# Altium schematic sheet SterUni_V1.SchDoc
size A4
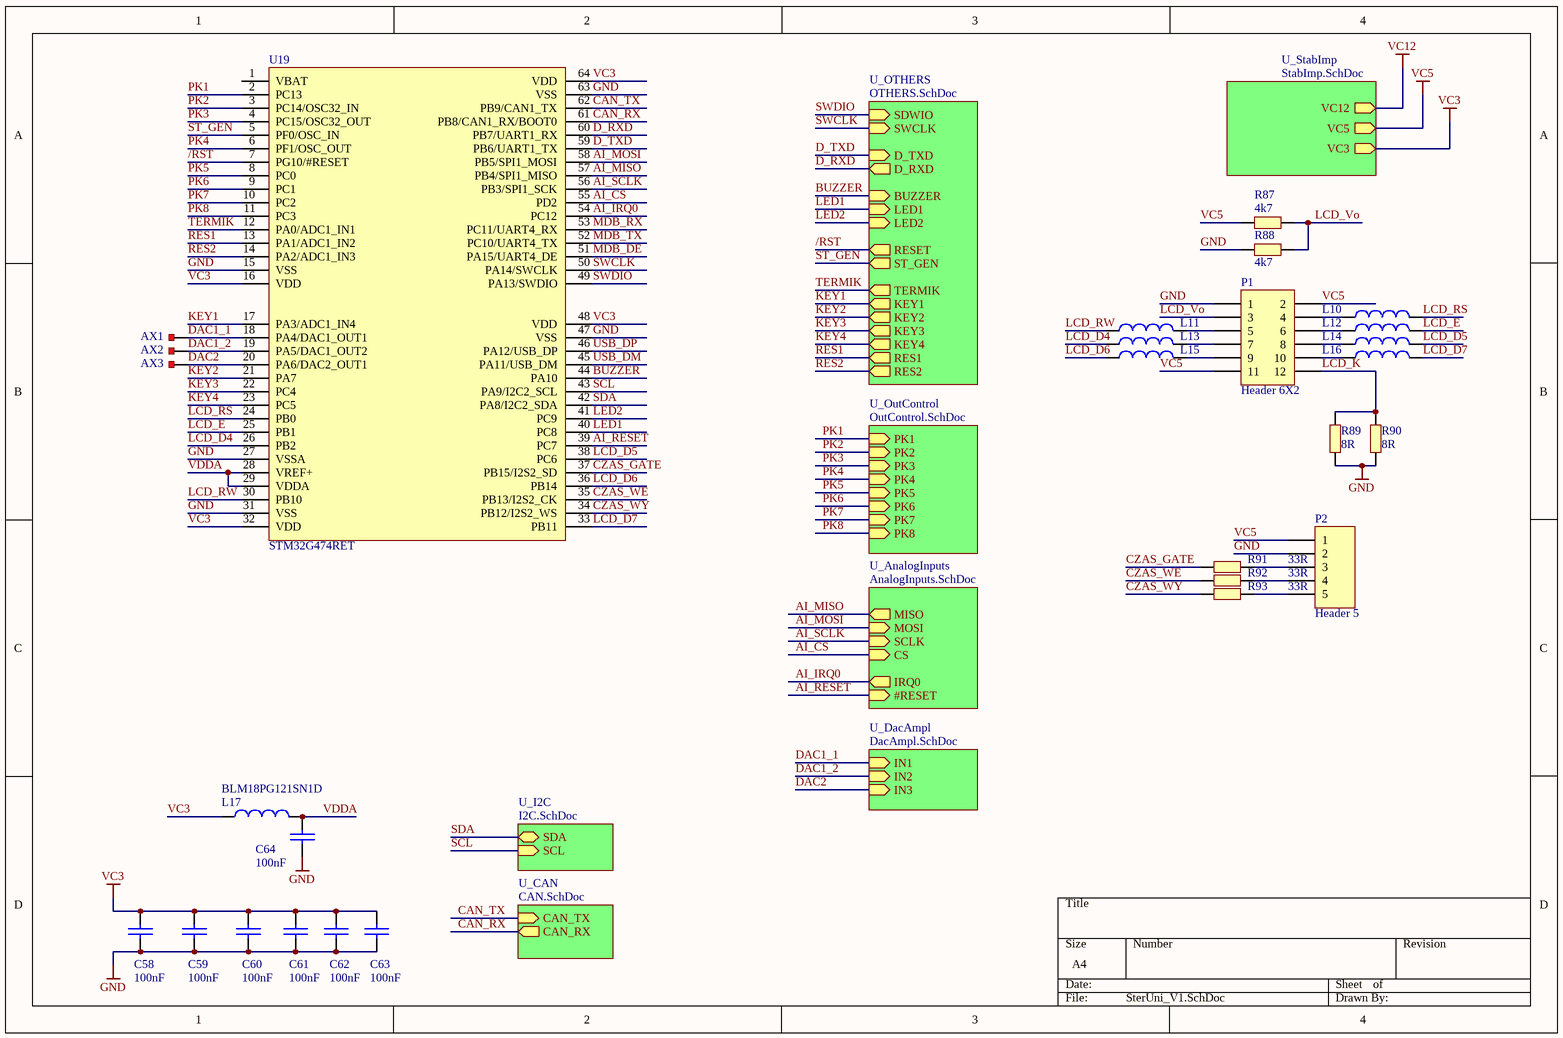
[diagram p0: SterUni_V1.SchDoc]

## Parts
AX1  (no value)  [PP_SMD4]
AX2  (no value)  [PP_SMD4]
AX3  (no value)  [PP_SMD4]
C58  100nF  [0603C]
C59  100nF  [0603C]
C60  100nF  [0603C]
C61  100nF  [0603C]
C62  100nF  [0603C]
C63  100nF  [0603C]
C64  100nF  [0603C]
L10  BLM18PG121SN1D  [0603L]  (value not drawn)
L11  BLM18PG121SN1D  [0603L]  (value not drawn)
L12  BLM18PG121SN1D  [0603L]  (value not drawn)
L13  BLM18PG121SN1D  [0603L]  (value not drawn)
L14  BLM18PG121SN1D  [0603L]  (value not drawn)
L15  BLM18PG121SN1D  [0603L]  (value not drawn)
L16  BLM18PG121SN1D  [0603L]  (value not drawn)
L17  BLM18PG121SN1D  [0603L]
P1  Header 6X2  [UMATCH-12]
P2  Header 5  [JST-B5B-XH-A]
R87  4k7  [0603R]
R88  4k7  [0603R]
R89  8R  [1206]
R90  8R  [1206]
R91  33R  [0603R]
R92  33R  [0603R]
R93  33R  [0603R]
U19  STM32G474RET  [LQFP64]

## Sub-sheets
U_AnalogInputs = AnalogInputs.SchDoc: MOSI (in), MISO (out), SCLK (in), CS (in), IRQ0 (out), #RESET (in)
U_CAN = CAN.SchDoc: CAN_RX (out), CAN_TX (in)
U_DacAmpl = DacAmpl.SchDoc: IN1 (in), IN2 (in), IN3 (in)
U_I2C = I2C.SchDoc: SCL (in), SDA (bidir)
U_OTHERS = OTHERS.SchDoc: SDWIO (in), SWCLK (in), D_TXD (in), D_RXD (out), RESET (out), LED1 (in), LED2 (in), ST_GEN (out), BUZZER (in), KEY1 (out), TERMIK (out), KEY2 (out), KEY3 (out), KEY4 (out), RES1 (out), RES2 (out)
U_OutControl = OutControl.SchDoc: PK1 (in), PK2 (in), PK3 (in), PK4 (in), PK5 (in), PK6 (in), PK7 (in), PK8 (in)
U_StabImp = StabImp.SchDoc: VC5 (out), VC3 (out), VC12 (out)

## Nets
GND: C58.2 C59.2 C60.2 C61.2 C62.2 C63.2 C64.2 P1.1 P2.2 R88.2 R89.2 R90.2 U19.15(VSS) U19.27(VSSA) U19.31(VSS) U19.47(VSS) U19.63(VSS)
VC3: C58.1 C59.1 C60.1 C61.1 C62.1 C63.1 L17.1 U19.16(VDD) U19.32(VDD) U19.48(VDD) U19.64(VDD) ; sheet U_StabImp/VC3
VC5: P1.2 P1.11 P2.1 R87.2 ; sheet U_StabImp/VC5
VC12: sheet U_StabImp/VC12
/RST: U19.7(PG10/#RESET) ; sheet U_OTHERS/RESET
AI_CS: U19.55(PD2) ; sheet U_AnalogInputs/CS
AI_IRQ0: U19.54(PC12) ; sheet U_AnalogInputs/IRQ0
AI_MISO: U19.57(PB4/SPI1_MISO) ; sheet U_AnalogInputs/MISO
AI_MOSI: U19.58(PB5/SPI1_MOSI) ; sheet U_AnalogInputs/MOSI
AI_RESET: U19.39(PC7) ; sheet U_AnalogInputs/#RESET
AI_SCLK: U19.56(PB3/SPI1_SCK) ; sheet U_AnalogInputs/SCLK
BUZZER: U19.44(PA10) ; sheet U_OTHERS/BUZZER
CAN_RX: U19.61(PB8/CAN1_RX/BOOT0) ; sheet U_CAN/CAN_RX
CAN_TX: U19.62(PB9/CAN1_TX) ; sheet U_CAN/CAN_TX
CZAS_GATE: R91.2 U19.37(PB15/I2S2_SD)
CZAS_WE: R92.2 U19.35(PB13/I2S2_CK)
CZAS_WY: R93.2 U19.34(PB12/I2S2_WS)
D_RXD: U19.60(PB7/UART1_RX) ; sheet U_OTHERS/D_RXD
D_TXD: U19.59(PB6/UART1_TX) ; sheet U_OTHERS/D_TXD
DAC1_1: AX1.1 U19.18(PA4/DAC1_OUT1) ; sheet U_DacAmpl/IN1
DAC1_2: AX2.1 U19.19(PA5/DAC1_OUT2) ; sheet U_DacAmpl/IN2
DAC2: AX3.1 U19.20(PA6/DAC2_OUT1) ; sheet U_DacAmpl/IN3
KEY1: U19.17(PA3/ADC1_IN4) ; sheet U_OTHERS/KEY1
KEY2: U19.21(PA7) ; sheet U_OTHERS/KEY2
KEY3: U19.22(PC4) ; sheet U_OTHERS/KEY3
KEY4: U19.23(PC5) ; sheet U_OTHERS/KEY4
LCD_D4: L13.1 U19.26(PB2)
LCD_D5: L14.2 U19.38(PC6)
LCD_D6: L15.1 U19.36(PB14)
LCD_D7: L16.2 U19.33(PB11)
LCD_E: L12.2 U19.25(PB1)
LCD_K: P1.12 R89.1 R90.1
LCD_RS: L10.2 U19.24(PB0)
LCD_RW: L11.1 U19.30(PB10)
LCD_Vo: P1.3 R87.1 R88.1
LED1: U19.40(PC8) ; sheet U_OTHERS/LED1
LED2: U19.41(PC9) ; sheet U_OTHERS/LED2
MDB_DE: U19.51(PA15/UART4_DE)
MDB_RX: U19.53(PC11/UART4_RX)
MDB_TX: U19.52(PC10/UART4_TX)
PK1: U19.2(PC13) ; sheet U_OutControl/PK1
PK2: U19.3(PC14/OSC32_IN) ; sheet U_OutControl/PK2
PK3: U19.4(PC15/OSC32_OUT) ; sheet U_OutControl/PK3
PK4: U19.6(PF1/OSC_OUT) ; sheet U_OutControl/PK4
PK5: U19.8(PC0) ; sheet U_OutControl/PK5
PK6: U19.9(PC1) ; sheet U_OutControl/PK6
PK7: U19.10(PC2) ; sheet U_OutControl/PK7
PK8: U19.11(PC3) ; sheet U_OutControl/PK8
RES1: U19.13(PA1/ADC1_IN2) ; sheet U_OTHERS/RES1
RES2: U19.14(PA2/ADC1_IN3) ; sheet U_OTHERS/RES2
SCL: U19.43(PA9/I2C2_SCL) ; sheet U_I2C/SCL
SDA: U19.42(PA8/I2C2_SDA) ; sheet U_I2C/SDA
ST_GEN: U19.5(PF0/OSC_IN) ; sheet U_OTHERS/ST_GEN
SWCLK: U19.50(PA14/SWCLK) ; sheet U_OTHERS/SWCLK
SWDIO: U19.49(PA13/SWDIO) ; sheet U_OTHERS/SDWIO
TERMIK: U19.12(PA0/ADC1_IN1) ; sheet U_OTHERS/TERMIK
USB_DM: U19.45(PA11/USB_DM)
USB_DP: U19.46(PA12/USB_DP)
VDDA: C64.1 L17.2 U19.28(VREF+) U19.29(VDDA)
NetL10_1: L10.1 P1.4
NetL11_2: L11.2 P1.5
NetL12_1: L12.1 P1.6
NetL13_2: L13.2 P1.7
NetL14_1: L14.1 P1.8
NetL15_2: L15.2 P1.9
NetL16_1: L16.1 P1.10
NetP2_3: P2.3 R91.1
NetP2_4: P2.4 R92.1
NetP2_5: P2.5 R93.1

Not connected (* = marked no-connect by the designer): U19 1(VBAT)

## Library data of the parts
AX1-AX3 = PP_RT
C58-C64 = CAP: Capacitor
L10-L17 = BEAD_120R_2A_0603: Bead,120R,2A,0603,BLM18PG121SN1D,MURATA; Manuf_Part_3: FCM1608KF-601T03; Manuf_2: TDK; Manuf_Part_2: MPZ1608S300A; Manuf_3: Tai-tech; Value: 100uH; Description_3: Bead,600R,350mA,0603,FCM1608KF-601T03,Tai-tech; Description_2: Bead,30R,5A,0603,MPZ1608S300A,TDK; Revision: July-2002: Re-released for DXP Platform.; ECCN_US/EU: n/a; Manuf_Part_1: BLM18PG121SN1D; Manuf_1: MURATA
P1 = Header 6X2: Header, 6-Pin, Dual row; LatestRevisionDate: 17-Jul-2002; LatestRevisionNote: Re-released for DXP Platform.; Publisher: Altium Limited
P2 = Header 5: Header, 5-Pin; LatestRevisionDate: 17-Jul-2002; LatestRevisionNote: Re-released for DXP Platform.; Publisher: Altium Limited
R87-R93 = RES3
U19 = STM32FG474RET